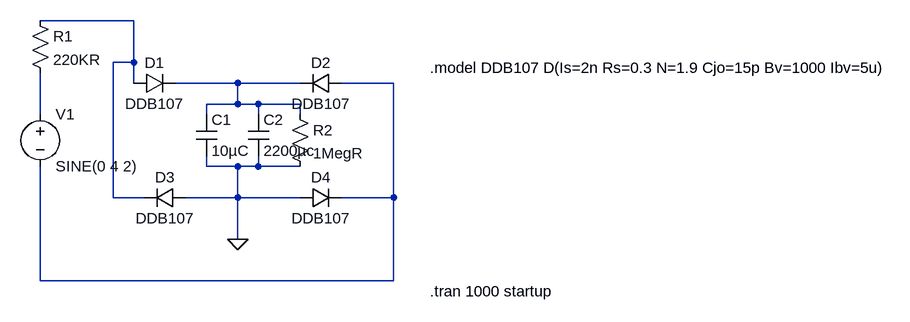
[diagram p0: schematic db107.asc]
db107.asc, the LTspice schematic file:
Version 4.1
SHEET 1 1364 680
WIRE 128 -96 -16 -96
WIRE 128 -32 128 -96
WIRE 128 -32 96 -32
WIRE 128 0 128 -32
WIRE 288 0 192 0
WIRE 384 0 288 0
WIRE 528 0 448 0
WIRE 288 32 288 0
WIRE 288 32 240 32
WIRE 320 32 288 32
WIRE 384 32 320 32
WIRE -16 48 -16 -16
WIRE 240 48 240 32
WIRE 320 48 320 32
WIRE 384 48 384 32
WIRE 240 128 240 112
WIRE 288 128 240 128
WIRE 320 128 320 112
WIRE 320 128 288 128
WIRE 384 128 320 128
WIRE 96 176 96 -32
WIRE 144 176 96 176
WIRE 288 176 288 128
WIRE 288 176 208 176
WIRE 384 176 288 176
WIRE 528 176 528 0
WIRE 528 176 448 176
WIRE 288 240 288 176
WIRE -16 304 -16 128
WIRE 528 304 528 176
WIRE 528 304 -16 304
FLAG 288 240 0
SYMBOL diode 128 16 R270
WINDOW 0 32 32 VTop 2
WINDOW 3 0 32 VBottom 2
SYMATTR InstName D1
SYMATTR Value DDB107
SYMBOL diode 448 -16 R90
WINDOW 0 0 32 VBottom 2
WINDOW 3 32 32 VTop 2
SYMATTR InstName D2
SYMATTR Value DDB107
SYMBOL diode 208 160 R90
WINDOW 0 0 32 VBottom 2
WINDOW 3 32 32 VTop 2
SYMATTR InstName D3
SYMATTR Value DDB107
SYMBOL diode 384 192 R270
WINDOW 0 32 32 VTop 2
WINDOW 3 0 32 VBottom 2
SYMATTR InstName D4
SYMATTR Value DDB107
SYMBOL res -32 -112 R0
SYMATTR InstName R1
SYMATTR Value 220KR
SYMBOL voltage -16 32 R0
WINDOW 123 0 0 Left 0
WINDOW 39 0 0 Left 0
SYMATTR InstName V1
SYMATTR Value SINE(0 4 2)
SYMBOL cap 224 48 R0
SYMATTR InstName C1
SYMATTR Value 10µC
SYMBOL cap 304 48 R0
SYMATTR InstName C2
SYMATTR Value 2200µc
SYMBOL res 368 32 R0
SYMATTR InstName R2
SYMATTR Value 1MegR
TEXT 584 -24 Left 2 !.model DDB107 D(Is=2n Rs=0.3 N=1.9 Cjo=15p Bv=1000 Ibv=5u)
TEXT 584 320 Left 2 !.tran 1000 startup

The netlist it stands for:
* db107.asc
D1 N001 N002 DDB107
D2 N003 N002 DDB107
D3 0 N001 DDB107
D4 0 N003 DDB107
R1 N001 N004 220KR
V1 N004 N003 SINE(0 4 2)
C1 N002 0 10µC
C2 N002 0 2200µc
R2 N002 0 1MegR
.model D D
.lib standard.dio
.model DDB107 D(Is=2n Rs=0.3 N=1.9 Cjo=15p Bv=1000 Ibv=5u)
.tran 1000 startup
.backanno
.end